# Altium schematic sheet NASCO Alarm Interface.SchDoc: NASCO ALARM INTERFACE
size A4; Title2: TOP LEVEL
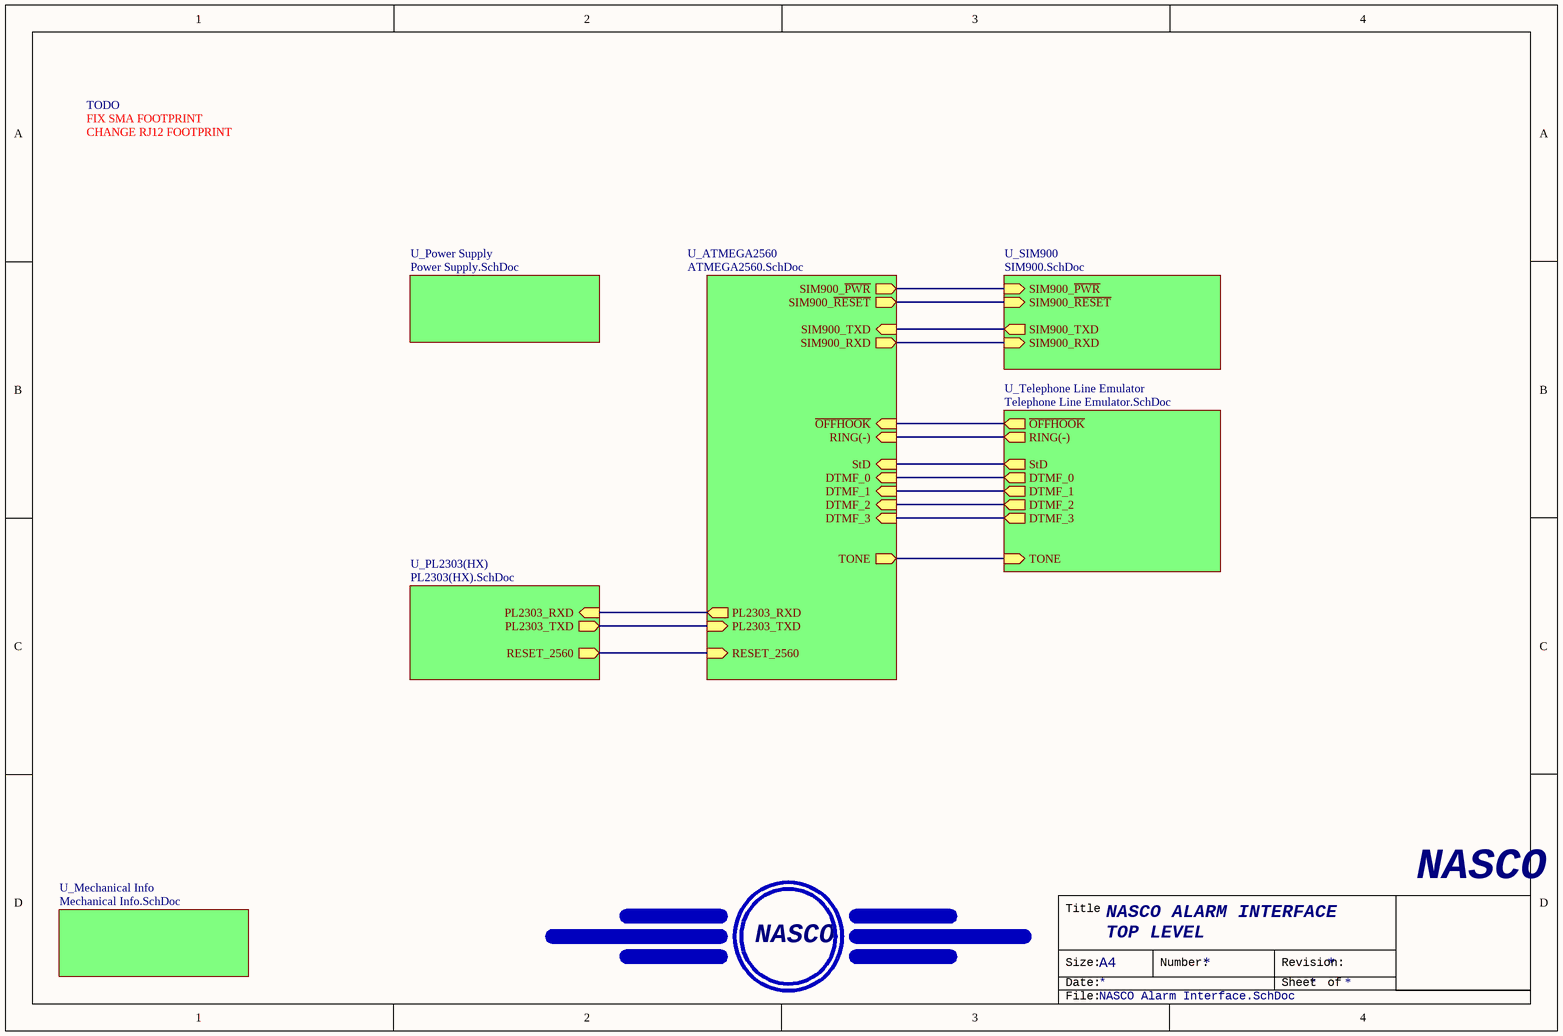
[diagram p0: NASCO Alarm Interface.SchDoc]

## Parts
?  (no value)  (no BOM)
LOGO1  NASCO  [NASCO_LOGO]  (value not drawn)  (no BOM)

## Sub-sheets
U_ATMEGA2560 = ATMEGA2560.SchDoc: DTMF_1 (in), ~{OFFHOOK} (in), DTMF_2 (in), DTMF_0 (in), SIM900_~{RESET} (out), SIM900_~{PWR} (out), TONE (out), SIM900_TXD (in), SIM900_RXD (out), StD (in), DTMF_3 (in), PL2303_RXD (out), PL2303_TXD (in), RESET_2560 (in), RING(-) (in)
U_Mechanical Info = Mechanical Info.SchDoc: no entries
U_PL2303(HX) = PL2303(HX).SchDoc: PL2303_TXD (out), PL2303_RXD (in), RESET_2560 (out)
U_Power Supply = Power Supply.SchDoc: no entries
U_SIM900 = SIM900.SchDoc: SIM900_~{PWR} (in), SIM900_~{RESET} (in), SIM900_RXD (in), SIM900_TXD (out)
U_Telephone Line Emulator = Telephone Line Emulator.SchDoc: ~{OFFHOOK} (out), StD (out), DTMF_0 (out), DTMF_1 (out), DTMF_2 (out), DTMF_3 (out), TONE (in), RING(-) (out)

## Nets
(unnamed): sheet U_SIM900/SIM900_~{PWR}, sheet U_ATMEGA2560/SIM900_~{PWR}
(unnamed): sheet U_SIM900/SIM900_~{RESET}, sheet U_ATMEGA2560/SIM900_~{RESET}
(unnamed): sheet U_SIM900/SIM900_RXD, sheet U_ATMEGA2560/SIM900_RXD
(unnamed): sheet U_SIM900/SIM900_TXD, sheet U_ATMEGA2560/SIM900_TXD
(unnamed): sheet U_Telephone Line Emulator/~{OFFHOOK}, sheet U_ATMEGA2560/~{OFFHOOK}
(unnamed): sheet U_Telephone Line Emulator/StD, sheet U_ATMEGA2560/StD
(unnamed): sheet U_Telephone Line Emulator/DTMF_0, sheet U_ATMEGA2560/DTMF_0
(unnamed): sheet U_Telephone Line Emulator/DTMF_1, sheet U_ATMEGA2560/DTMF_1
(unnamed): sheet U_Telephone Line Emulator/DTMF_2, sheet U_ATMEGA2560/DTMF_2
(unnamed): sheet U_Telephone Line Emulator/DTMF_3, sheet U_ATMEGA2560/DTMF_3
(unnamed): sheet U_Telephone Line Emulator/TONE, sheet U_ATMEGA2560/TONE
(unnamed): sheet U_Telephone Line Emulator/RING(-), sheet U_ATMEGA2560/RING(-)
(unnamed): sheet U_PL2303(HX)/PL2303_TXD, sheet U_ATMEGA2560/PL2303_TXD
(unnamed): sheet U_PL2303(HX)/PL2303_RXD, sheet U_ATMEGA2560/PL2303_RXD
(unnamed): sheet U_PL2303(HX)/RESET_2560, sheet U_ATMEGA2560/RESET_2560

## Notes on the sheet
- TODO
- FIX SMA FOOTPRINT
- CHANGE RJ12 FOOTPRINT
- Title
- NASCO
- Size:
- Date:
- A4
- Number:
- Revision:
- Sheet
- of
- File:

## Library data of the parts
? = NASCO_LOGO: LOGO
LOGO1 = NASCO_LOGO: Quad 2-Input OR Gate